# Altium project CanSat.PrjPcb (part 1 of 3)
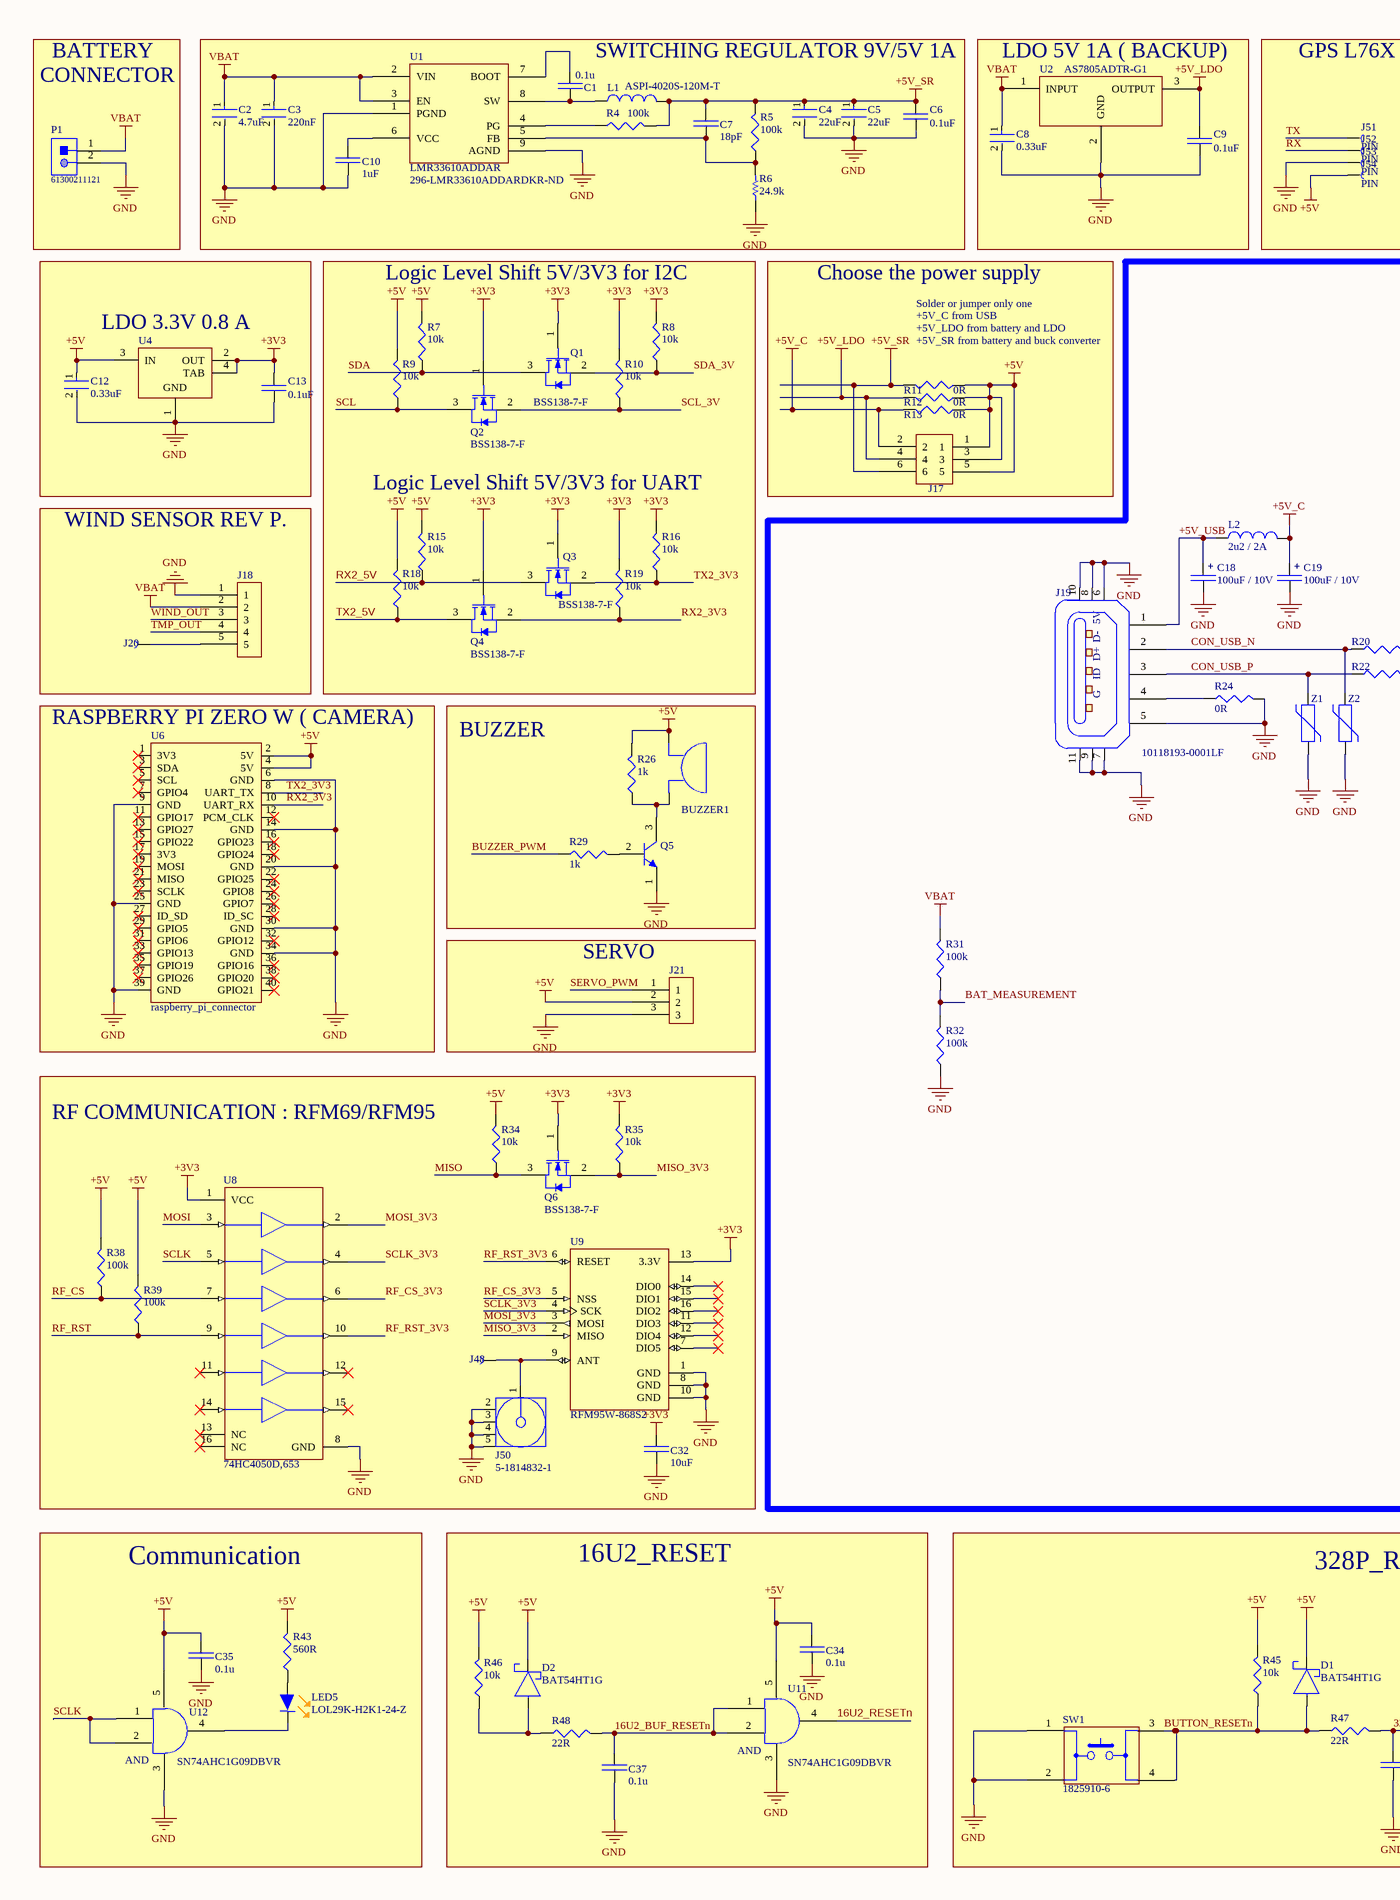
[diagram p0: schematics.SchDoc, left]
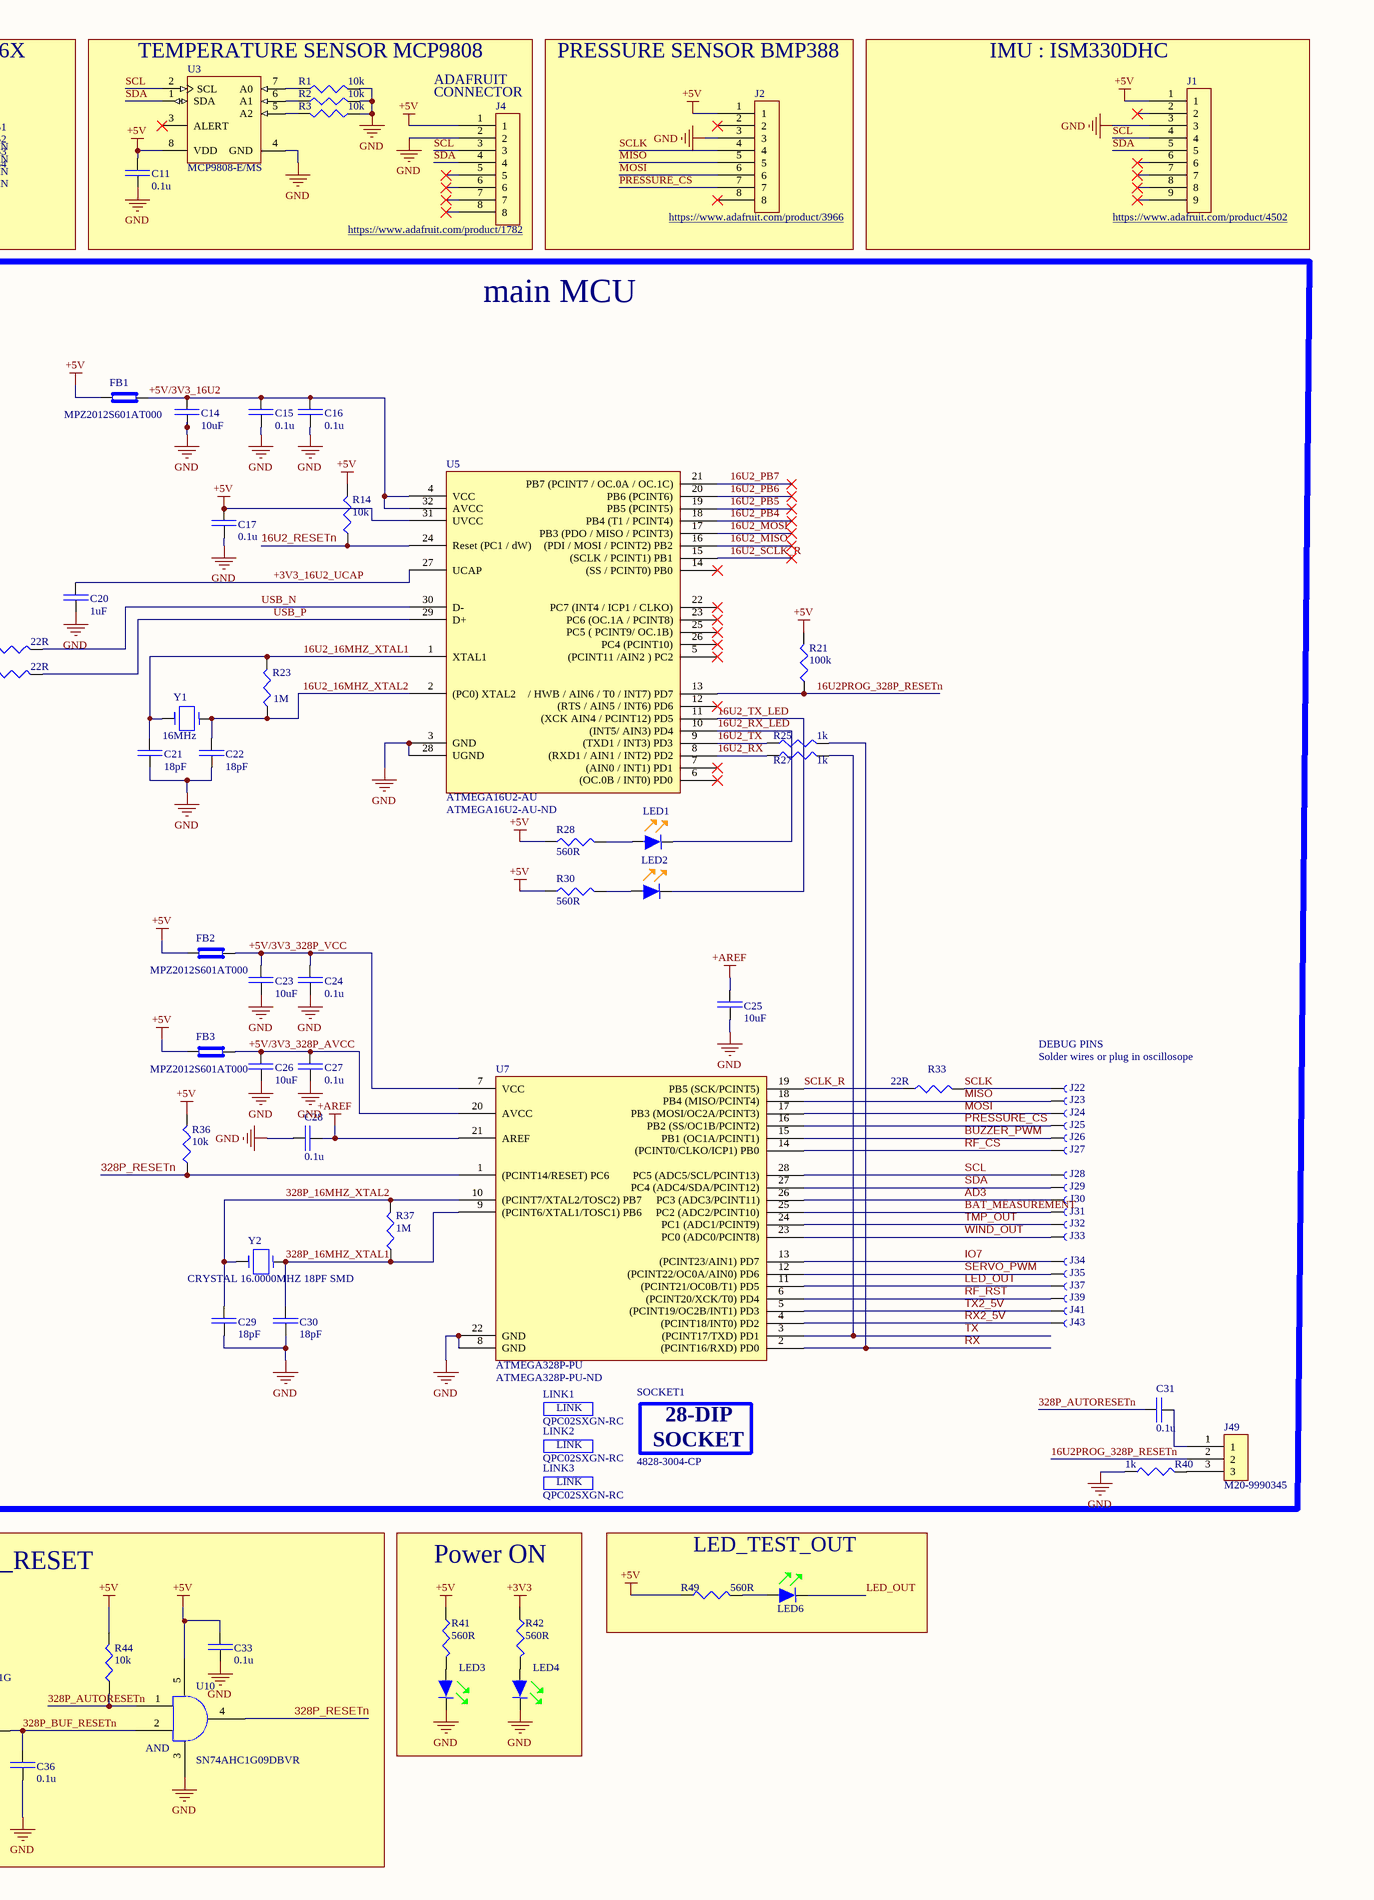
[diagram p1: schematics.SchDoc, right]
1 sheet, 160 parts. Net scope: global (net labels, ports and power ports of the same name join across sheets).
Board file: PCB1.PcbDoc

## Sheet schematics.SchDoc
size A2

### Parts
BUZZER1  PS1420P02CT  [PS1420P02CT]  (value not drawn)
C1  0.1u  [CAP_603]
C2  4.7uF  [FP-CL21-IPC_B]
C3  220nF  [FP-CC0603-DA-MFG]
C4  22uF  [FP-CL31-IPC_A]
C5  22uF  [FP-CL31-IPC_A]
C6  0.1uF  [CAP_603]
C7  18pF  [CAP_603]
C8  0.33uF  [FP-CL21-F-IPC_C]
C9  0.1uF  [CAP_603]
C10  1uF  [CAP_603]
C11  0.1u  [CAP_603]
C12  0.33uF  [FP-CL21-F-IPC_C]
C13  0.1uF  [CAP_603]
C14  10uF  [CAP_0805]
C15  0.1u  [CAP_603]
C16  0.1u  [CAP_603]
C17  0.1u  [CAP_603]
C18  100uF / 10V  [EEE-1AA101WR]
C19  100uF / 10V  [EEE-1AA101WR]
C20  1uF  [CAP_603]
C21  18pF  [CAP_603]
C22  18pF  [CAP_603]
C23  10uF  [CAP_0805]
C24  0.1u  [CAP_603]
C25  10uF  [CAP_0805]
C26  10uF  [CAP_0805]
C27  0.1u  [CAP_603]
C28  0.1u  [CAP_603]
C29  18pF  [CAP_603]
C30  18pF  [CAP_603]
C31  0.1u  [CAP_603]
C32  10uF  [CAP_0805]
C33  0.1u  [CAP_603]
C34  0.1u  [CAP_603]
C35  0.1u  [CAP_603]
C36  0.1u  [CAP_603]
C37  0.1u  [CAP_603]
D1  BAT54HT1G  [BAT54HT1G]
D2  BAT54HT1G  [BAT54HT1G]
FB1  MPZ2012S601AT000  [FB_0805]
FB2  MPZ2012S601AT000  [FB_0805]
FB3  MPZ2012S601AT000  [FB_0805]
J1  https://www.adafruit.com/product/4502  [ISM330DHCX_adafruit]
J2  https://www.adafruit.com/product/3966  [BMP388_adafruit]
J4  https://www.adafruit.com/product/1782  [MCP9808_adafruit]
J17  M20-9760346  [HEADER_MALE_2x3PIN]  (value not drawn)
J18  M20-9990546 (3)  [HEADER_MALE_1X5]  (value not drawn)
J19  10118193-0001LF  [10118193-0001LF]
J20  PIN  [PIN]  (value not drawn)
J21  M20-9990345  [HEADER_MALE_1x3]  (value not drawn)
J22  PIN  [PIN]  (value not drawn)
J23  PIN  [PIN]  (value not drawn)
J24  PIN  [PIN]  (value not drawn)
J25  PIN  [PIN]  (value not drawn)
J26  PIN  [PIN]  (value not drawn)
J27  PIN  [PIN]  (value not drawn)
J28  PIN  [PIN]  (value not drawn)
J29  PIN  [PIN]  (value not drawn)
J30  PIN  [PIN]  (value not drawn)
J31  PIN  [PIN]  (value not drawn)
J32  PIN  [PIN]  (value not drawn)
J33  PIN  [PIN]  (value not drawn)
J34  PIN  [PIN]  (value not drawn)
J35  PIN  [PIN]  (value not drawn)
J37  PIN  [PIN]  (value not drawn)
J39  PIN  [PIN]  (value not drawn)
J41  PIN  [PIN]  (value not drawn)
J43  PIN  [PIN]  (value not drawn)
J48  PIN  [PIN]  (value not drawn)
J49  M20-9990345  [HEADER_MALE_1x3]
J50  5-1814832-1  [TECO-5-1814832-1_V]
J51  PIN  [PIN]
J52  PIN  [PIN]
J53  PIN  [PIN]
J54  PIN  [PIN]
L1  ASPI-4020S-120M-T  [ASPI-4020S]
L2  2u2 / 2A  [L_1210]
LED1  LOL29K-H2K1-24-Z  [LED_0603]  (value not drawn)
LED2  LOL29K-H2K1-24-Z  [LED_0603]  (value not drawn)
LED3  LGL29K-F2J1-24-Z  [LED_0603]  (value not drawn)
LED4  LGL29K-F2J1-24-Z  [LED_0603]  (value not drawn)
LED5  LOL29K-H2K1-24-Z  [LED_0603]
LED6  LGL29K-F2J1-24-Z  [LED_0603]  (value not drawn)
LINK1  QPC02SXGN-RC  (mechanical)
LINK2  QPC02SXGN-RC  (mechanical)
LINK3  QPC02SXGN-RC  (mechanical)
P1  61300211121  [61300211121]
Q1  BSS138-7-F  [DIOD-SOT23-3_V]
Q2  BSS138-7-F  [DIOD-SOT23-3_V]
Q3  BSS138-7-F  [DIOD-SOT23-3_V]
Q4  BSS138-7-F  [DIOD-SOT23-3_V]
Q5  2SC2412KT146R  [ROHM-SOT-346-3_V]  (value not drawn)
Q6  BSS138-7-F  [DIOD-SOT23-3_V]
R1  10k  [R_0603]
R2  10k  [R_0603]
R3  10k  [R_0603]
R4  100k  [R_0603]
R5  100k  [R_0603]
R6  24.9k  [RESC1608X55X30LL15T15]
R7  10k  [R_0603]
R8  10k  [R_0603]
R9  10k  [R_0603]
R10  10k  [R_0603]
R11  0R  [R_0603]
R12  0R  [R_0603]
R13  0R  [R_0603]
R14  10k  [R_0603]
R15  10k  [R_0603]
R16  10k  [R_0603]
R18  10k  [R_0603]
R19  10k  [R_0603]
R20  22R  [R_0805]
R21  100k  [R_0603]
R22  22R  [R_0805]
R23  1M  [R_0603]
R24  0R  [R_0603]
R25  1k  [R_0603]
R26  1k  [R_0603]
R27  1k  [R_0603]
R28  560R  [R_0603]
R29  1k  [R_0603]
R30  560R  [R_0603]
R31  100k  [R_0603]
R32  100k  [R_0603]
R33  22R  [R_0805]
R34  10k  [R_0603]
R35  10k  [R_0603]
R36  10k  [R_0603]
R37  1M  [R_0603]
R38  100k  [R_0603]
R39  100k  [R_0603]
R40  1k  [R_0603]
R41  560R  [R_0603]
R42  560R  [R_0603]
R43  560R  [R_0603]
R44  10k  [R_0603]
R45  10k  [R_0603]
R46  10k  [R_0603]
R47  22R  [R_0805]
R48  22R  [R_0805]
R49  560R  [R_0603]
SOCKET1  4828-3004-CP  (mechanical)
SW1  1825910-6  [BUTTON]
U1  LMR33610ADDAR  Supplier Part Number 1: 296-LMR33610ADDARDKR-ND  [HSOIC8]
U2  AS7805ADTR-G1  [TO-252]
U3  MCP9808-E/MS  [MCHP-MSOP-MS8_L]
U4  LM1117MPX-3.3/NOPB  [DCY0004A_L]  (value not drawn)
U5  ATMEGA16U2-AU  Supplier Part Number 1: ATMEGA16U2-AU-ND  [TQFP32]
U6  raspberry_pi_connector  [raspberry_pi]
U7  ATMEGA328P-PU  Supplier Part Number 1: ATMEGA328P-PU-ND  [DIP28_7.62mm]
U8  74HC4050D,653  [FP-SOT109-1-MFG]
U9  RFM95W-868S2  [RFM69HCW]
U10  SN74AHC1G09DBVR  [SOT-23]
U11  SN74AHC1G09DBVR  [SOT-23]
U12  SN74AHC1G09DBVR  [SOT-23]
Y1  16MHz  [ABM7_v1_1_BIG]
Y2  CRYSTAL 16.0000MHZ 18PF SMD  [ABM7_v1_1_BIG]
Z1  CG0603MLC-05E  [CG0603MLC-05E]  (value not drawn)
Z2  CG0603MLC-05E  [CG0603MLC-05E]  (value not drawn)

### Blocks framed on the sheet
SWITCHING REGULATOR 9V/5V 1A: C1-C7 C10 L1 R4-R6 U1
LDO 5V 1A ( BACKUP): C8 C9 U2
GPS L76X: J51-J54
TEMPERATURE SENSOR MCP9808: C11 J4 R1-R3 U3
PRESSURE SENSOR BMP388: J2
IMU : ISM330DHC: J1
LDO 3.3V 0.8 A: C12 C13 U4
Choose the power supply: J17 R11-R13
main MCU: C14-C31 FB1-FB3 J19 J22-J35 J37 J39 J41 J43 J49 L2 LED1 LED2 LINK1-LINK3 R14 R20-R25 R27 R28 R30-R33 R36 R37 R40 SOCKET1 U5 U7 Y1 Y2 Z1 Z2
WIND SENSOR REV P.: J18 J20
RASPBERRY PI ZERO W ( CAMERA): U6
BUZZER: BUZZER1 Q5 R26 R29
SERVO: J21
RF COMMUNICATION : RFM69/RFM95: C32 J48 J50 Q6 R34 R35 R38 R39 U8 U9
Communication: C35 LED5 R43 U12
16U2_RESET: C34 C37 D2 R46 R48 U11
328P_RESET: C33 C36 D1 R44 R45 R47 SW1 U10
Power ON: LED3 LED4 R41 R42
LED_TEST_OUT: LED6 R49

### Nets
+3V3: C13.1 C32.2 Q1.1(G) Q2.1(G) Q3.1(G) Q4.1(G) Q6.1(G) R8.2 R10.2 R16.2 R19.2 R35.2 R42.1 U4.2(OUT) U4.4(TAB) U8.1(VCC) U9.13(3.3V)
+5V: BUZZER1.1 C11.1 C12.1 C17.2 C33.1 C34.1 C35.2 D1.1 D2.1 FB1.1 FB2.1 FB3.1 J1.1 J2.1 J4.1 J17.1 J17.3 J17.5 J21.2 J54.1 R7.2 R9.2 R11.1 R12.1 R13.1 R14.2 R15.2 R18.2 R21.2 R26.2 R28.1 R30.1 R34.2 R36.2 R38.2 R39.2 R41.1 R43.2 R44.2 R45.2 R46.2 R49.1 U3.8(VDD) U4.3(IN) U5.31(UVCC) U6.2(5V) U6.4(5V) U10.5 U11.5 U12.5
+5V_C: C19.1 J17.2 L2.2 R13.2
+5V_LDO: C9.1 J17.4 R12.2 U2.3(OUTPUT)
+5V_SR: C4.1 C5.1 C6.1 C7.1 J17.6 L1.2 R4.2 R5.2 R11.2
+AREF: C25.2 C28.2 U7.21(AREF)
GND: C2.2 C3.2 C4.2 C5.2 C6.2 C8.2 C9.2 C10.1 C11.2 C12.2 C13.2 C14.1 C15.1 C16.1 C17.1 C18.2 C19.2 C20.1 C21.1 C22.1 C23.1 C24.1 C25.1 C26.1 C27.1 C28.1 C29.1 C30.1 C32.1 C33.2 C34.2 C35.1 C36.1 C37.1 J1.3 J2.3 J4.2 J18.1 J19.5 J19.6 J19.7 J19.8 J19.9 J19.10 J19.11 J21.3 J50.2 J50.3 J50.4 J50.5 J53.1 LED3.1 LED4.1 P1.2 Q5.1(E) R1.2 R2.2 R3.1 R6.1 R24.2 R32.1 R40.1 SW1.1 SW1.2 U1.1(PGND) U1.9(AGND) U2.2(GND) U3.4(GND) U4.1(GND) U5.3(GND) U5.28(UGND) U6.6(GND) U6.9(GND) U6.14(GND) U6.20(GND) U6.25(GND) U6.30(GND) U6.34(GND) U6.39(GND) U7.8(GND) U7.22(GND) U8.8(GND) U9.1(GND) U9.8(GND) U9.10(GND) U10.3 U11.3 U12.3 Z1.1 Z2.1
VBAT: C2.1 C3.1 C8.1 J18.2 P1.1 R31.2 U1.2(VIN) U1.3(EN) U2.1(INPUT)
16U2_16MHZ_XTAL1: C21.2 R23.2 U5.1(XTAL1) Y1.1
16U2_16MHZ_XTAL2: C22.2 R23.1 U5.2((PC0)_XTAL2) Y1.2
16U2_BUF_RESETn: C37.2 R48.2 U11.1 U11.2
16U2_MISO: U5.16((PDI_/_MOSI_/_PCINT2)_PB2)
16U2_MOSI: U5.17(PB3_(PDO_/_MISO_/_PCINT3))
16U2_PB4: U5.18(PB4_(T1_/_PCINT4))
16U2_PB5: U5.19(PB5_(PCINT5))
16U2_PB6: U5.20(PB6_(PCINT6))
16U2_PB7: U5.21(PB7_(PCINT7_/_OC.0A_/_OC.1C))
16U2_RESETn: R14.1 U5.24(Reset_(PC1_/_dW)) U11.4
16U2_RX: R27.1 U5.8((RXD1_/_AIN1_/_INT2)_PD2)
16U2_RX_LED: LED1.1 U5.10((INT5/_AIN3)_PD4)
16U2_SCLK_R: U5.15((SCLK_/_PCINT1)_PB1)
16U2_TX: R25.1 U5.9((TXD1_/_INT3)_PD3)
16U2_TX_LED: LED2.1 U5.11((XCK_AIN4_/_PCINT12)_PD5)
16U2PROG_328P_RESETn: J49.2 R21.1 U5.13(/_HWB_/_AIN6_/_T0_/_INT7)_PD7)
328P_16MHZ_XTAL1: C30.2 R37.1 U7.9((PCINT6/XTAL1/TOSC1)_PB6) Y2.2
328P_16MHZ_XTAL2: C29.2 R37.2 U7.10((PCINT7/XTAL2/TOSC2)_PB7) Y2.1
328P_AUTORESETn: C31.1 R44.1 U10.1
328P_BUF_RESETn: C36.2 R47.2 U10.2
328P_RESETn: R36.1 U7.1((PCINT14/RESET)_PC6) U10.4
+3V3_16U2_UCAP: C20.2 U5.27(UCAP)
+5V/3V3_16U2: C14.2 C15.2 C16.2 FB1.2 U5.4(VCC) U5.32(AVCC)
+5V/3V3_328P_AVCC: C26.2 C27.2 FB3.2 U7.20(AVCC)
+5V/3V3_328P_VCC: C23.2 C24.2 FB2.2 U7.7(VCC)
+5V_USB: C18.1 J19.1 L2.1
AD3: J30.1 U7.26(PC3_(ADC3/PCINT11))
BAT_MEASUREMENT: J31.1 R31.1 R32.2 U7.25(PC2_(ADC2/PCINT10))
BUTTON_RESETn: D1.2 R45.1 R47.1 SW1.3 SW1.4
BUZZER_PWM: J26.1 R29.1 U7.15(PB1_(OC1A/PCINT1))
CON_USB_N: J19.2 R20.1 Z2.2
CON_USB_P: J19.3 R22.1 Z1.2
IO7: J34.1 U7.13((PCINT23/AIN1)_PD7)
LED_OUT: J37.1 LED6.1 U7.11((PCINT21/OC0B/T1)_PD5)
MISO: J2.5 J23.1 Q6.3(D) R34.1 U7.18(PB4_(MISO/PCINT4))
MISO_3V3: Q6.2(S) R35.1 U9.2(MISO)
MOSI: J2.6 J24.1 U7.17(PB3_(MOSI/OC2A/PCINT3)) U8.3(1A)
MOSI_3V3: U8.2(1Y) U9.3(MOSI)
PRESSURE_CS: J2.7 J25.1 U7.16(PB2_(SS/OC1B/PCINT2))
RF_CS: J27.1 R38.1 U7.14((PCINT0/CLKO/ICP1)_PB0) U8.7(3A)
RF_CS_3V3: U8.6(3Y) U9.5(NSS)
RF_RST: J39.1 R39.1 U7.6((PCINT20/XCK/T0)_PD4) U8.9(4A)
RF_RST_3V3: U8.10(4Y) U9.6(RESET)
RX: J52.1 R25.2 U7.2((PCINT16/RXD)_PD0)
RX2_3V3: Q4.2(S) R19.1 U6.10(UART_RX)
RX2_5V: J43.1 Q3.3(D) R15.1 U7.4((PCINT18/INT0)_PD2)
SCL: J1.4 J4.3 J28.1 Q2.3(D) R9.1 U3.2(SCL) U7.28(PC5_(ADC5/SCL/PCINT13))
SCL_3V: Q2.2(S) R10.1
SCLK: J2.4 J22.1 R33.2 U8.5(2A) U12.1 U12.2
SCLK_3V3: U8.4(2Y) U9.4(SCK)
SCLK_R: R33.1 U7.19(PB5_(SCK/PCINT5))
SDA: J1.5 J4.4 J29.1 Q1.3(D) R7.1 U3.1(SDA) U7.27(PC4_(ADC4/SDA/PCINT12))
SDA_3V: Q1.2(S) R8.1
SERVO_PWM: J21.1 J35.1 U7.12((PCINT22/OC0A/AIN0)_PD6)
TMP_OUT: J18.4 J32.1 U7.24(PC1_(ADC1/PCINT9))
TX: J51.1 R27.2 U7.3((PCINT17/TXD)_PD1)
TX2_3V3: Q3.2(S) R16.1 U6.8(UART_TX)
TX2_5V: J41.1 Q4.3(D) R18.1 U7.5((PCINT19/OC2B/INT1)_PD3)
USB_N: R20.2 U5.30(D-)
USB_P: R22.2 U5.29(D+)
WIND_OUT: J18.3 J33.1 U7.23(PC0_(ADC0/PCINT8))
NetBUZZER1_2: BUZZER1.2 Q5.3(C) R26.1
NetC1_1: C1.1 L1.1 U1.8(SW)
NetC1_2: C1.2 U1.7(BOOT)
NetC7_2: C7.2 R5.1 R6.2 U1.5(FB)
NetC10_2: C10.2 U1.6(VCC)
NetC31_2: C31.2 J49.1
NetD2_2: D2.2 R46.1 R48.1
NetJ18_5: J18.5 J20.1
NetJ19_4: J19.4 R24.1
NetJ48_1: J48.1 J50.1 U9.9(ANT)
NetJ49_3: J49.3 R40.2
NetLED1_2: LED1.2 R28.2
NetLED2_2: LED2.2 R30.2
NetLED3_2: LED3.2 R41.2
NetLED4_2: LED4.2 R42.2
NetLED5_1: LED5.1 U12.4
NetLED5_2: LED5.2 R43.1
NetLED6_2: LED6.2 R49.2
NetQ5_2: Q5.2(B) R29.2
NetR1_1: R1.1 U3.7(A0)
NetR2_1: R2.1 U3.6(A1)
NetR3_2: R3.2 U3.5(A2)
NetR4_1: R4.1 U1.4(PG)

Not connected (* = marked no-connect by the designer): J1 2* 6* 7* 8* 9*; J2 2* 8*; J4 5* 6* 7* 8*; U3 3(ALERT)*; U5 5((PCINT11_/AIN2_)_PC2)* 6((OC.0B_/_INT0)_PD0)* 7((AIN0_/_INT1)_PD1)* 12((RTS_/_AIN5_/_INT6)_PD6)* 14((SS_/_PCINT0)_PB0)* 22(PC7_(INT4_/_ICP1_/_CLKO))* 23(PC6_(OC.1A_/_PCINT8))* 25(PC5_(_PCINT9/_OC.1B))* 26(PC4_(PCINT10))*; U6 1(3V3)* 3(SDA)* 5(SCL)* 7(GPIO4)* 11(GPIO17)* 12(PCM_CLK)* 13(GPIO27)* 15(GPIO22)* 16(GPIO23)* 17(3V3)* 18(GPIO24)* 19(MOSI)* 21(MISO)* 22(GPIO25)* 23(SCLK)* 24(GPIO8)* 26(GPIO7)* 27(ID_SD)* 28(ID_SC)* 29(GPIO5)* 31(GPIO6)* 32(GPIO12)* 33(GPIO13)* 35(GPIO19)* 36(GPIO16)* 37(GPIO26)* 38(GPIO20)* 40(GPIO21)*; U8 11(5A)* 12(5Y)* 13(NC)* 14(6A)* 15(6Y)* 16(NC)*; U9 7(DIO5)* 11(DIO3)* 12(DIO4)* 14(DIO0)* 15(DIO1)* 16(DIO2)*

### Notes on the sheet
- CONNECTOR
- BATTERY
- (near J4) ADAFRUIT
- (near J4) CONNECTOR
- Logic Level Shift 5V/3V3 for I2C
- Solder or jumper only one
- +5V_C from USB
- +5V_LDO from battery and LDO
- +5V_SR from battery and buck converter
- Logic Level Shift 5V/3V3 for UART
- DEBUG PINS
- Solder wires or plug in oscillosope
- (in symbol 4828-3004-CP) 28-DIP; SOCKET
- (in symbol 10118193-0001LF) 5V; D-; D+; ID; G
- (in symbol EEE-1AA101WR) +
- (in symbol QPC02SXGN-RC) LINK
- (in symbol SN74AHC1G09DBVR) AND